# Altium schematic sheet Finger_IMU_PCB.SchDoc
size A; SheetNumber: 6; SheetTotal: 7
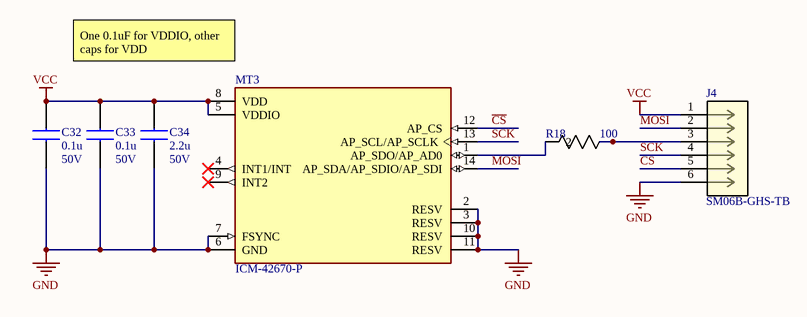
[diagram p0: Finger_IMU_PCB.SchDoc]

## Parts
C32  value 0.1u  Rated Voltage: 50V  [CAPC2012X145N]  (hidden comment: KAM21BR71H104JM)
C33  value 0.1u  Rated Voltage: 50V  [CAPC2012X145N]  (hidden comment: KAM21BR71H104JM)
C34  value 2.2u  Rated Voltage: 50V  [CAPC2012X145N]  (hidden comment: C2012X7R1H225K125AE)
J4  SM06B-GHS-TB  [CONN_SM06B-GHS-TB_JST]
MT3  ICM-42670-P  [XDCR_ICM-42670-P]
R18  value 100  [RC0805N_YAG]  (hidden comment: RC0805JR-07100RL)

## Nets
GND: C32.1 C33.1 C34.1 J4.6 MT3.2(RESV) MT3.3(RESV) MT3.6(GND) MT3.7(FSYNC) MT3.10(RESV) MT3.11(RESV)
VCC: C32.2 C33.2 C34.2 J4.1 MT3.5(VDDIO) MT3.8(VDD)
~{CS}: J4.5 MT3.12(AP_CS)
MOSI: J4.2 MT3.14(AP_SDA/AP_SDIO/AP_SDI)
SCK: J4.4 MT3.13(AP_SCL/AP_SCLK)
NetJ4_3: J4.3 R18.1
NetMT3_1: MT3.1(AP_SDO/AP_AD0) R18.2

Not connected (* = marked no-connect by the designer): MT3 4(INT1/INT)* 9(INT2)*

## Notes on the sheet
- (near MT3) One 0.1uF for VDDIO, other caps for VDD

## Library data of the parts
C32 C33 = KAM21BR71H104JM: Multilayer Ceramic Chip Capacitors, Capacitance=0.1u; Manufacturer_Part_Number: KAM21BR71H104JM
C34 = C2012X7R1H225K125AE: Multilayer Ceramic Chip Capacitors, Capacitance=2.2u; Manufacturer_Part_Number: C2012X7R1H225K125AE
J4 = SM06B-GHS-TB: No Description Available; Manufacturer_Name: JST; Copyright: Copyright (C) 2025 Ultra Librarian. All rights reserved.; Manufacturer_Part_Number: SM06B-GHS-TB; RefDes: RefDes; Type: Type
R18 = RC0805JR-07100RL: RES 0805 100 5% 1/8W; Manufacturer_Name: Yageo; Manufacturer_Part_Number: RC0805JR-07100RL; Tolerance: 5%
MT3 = ICM-42670-P: Package: None; Price: None; Value: *; MP: ICM-42670-P; Availability: Unavailable